# Altium schematic sheet Power.SchDoc
size 254 x 190 mm; SheetNumber: 2; SheetTotal: 3
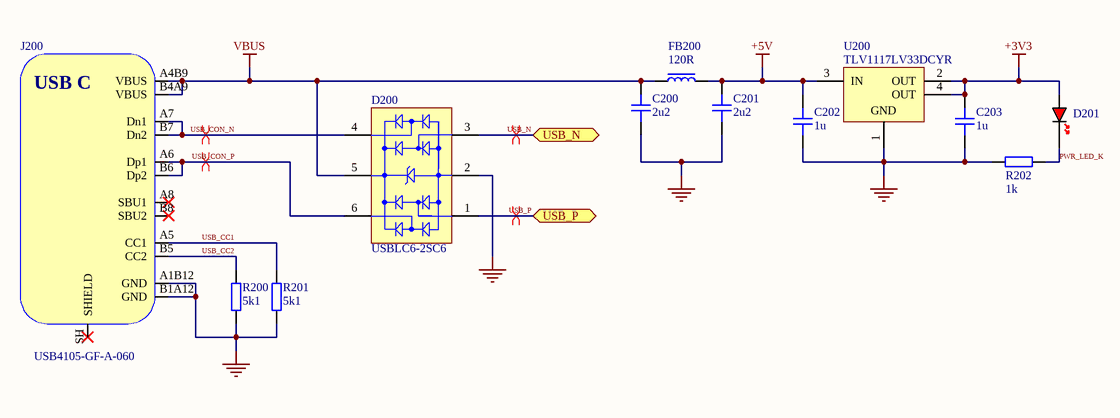
[diagram p0: Power.SchDoc]

## Parts
C200  2u2  [CAP_0805]
C201  2u2  [CAP_0805]
C202  1u  [CAP_0805]
C203  1u  [CAP_0805]
D200  USBLC6-2SC6  [STM-SOT23-6L_V]
D201  RED  [LED_0603_RED]  (value not drawn)
FB200  120R  [FB_0603]
J200  USB4105-GF-A-060  [USB4105-GF-A-060]
R200  5k1  [RES_0603]
R201  5k1  [RES_0603]
R202  1k  [RES_0603]
U200  TLV1117LV33DCYR  [DCY0004A_N]

## Ports
USB_N (bidir, see Overview[2B], Main[2B]), USB_P (bidir, see Overview[2B], Main[2B])

## Nets
+3V3: C203.1 D201.A U200.2(OUT) U200.4(OUT)
+5V: C201.1 C202.1 FB200.2 U200.3(IN)
GND: C200.1 C201.2 C202.2 C203.2 D200.2(GND) J200.A1B12(GND) J200.B1A12(GND) R200.1 R201.1 R202.2 U200.1(GND)
VBUS: C200.2 D200.5(VBUS) FB200.1 J200.A4B9(VBUS) J200.B4A9(VBUS)
PWR_LED_K: D201.K R202.1
USB_CC1: J200.A5(CC1) R201.2
USB_CC2: J200.B5(CC2) R200.2
USB_CON_N: D200.4(I/O_3) J200.A7(Dn1) J200.B7(Dn2)
USB_CON_P: D200.6(I/O_4) J200.A6(Dp1) J200.B6(Dp2)
USB_N: D200.3(I/O_2) ; port USB_N
USB_P: D200.1(I/O_1) ; port USB_P

Not connected (* = marked no-connect by the designer): J200 A8(SBU1)* B8(SBU2)* SH(SHIELD)*

## Layout directives
differential pair; differential pair class DIFF_USB_CON: USB_CON_N, USB_CON_P
differential pair; differential pair class DIFF_USB: USB_N, USB_P

## Notes on the sheet
- (in symbol USB4105-GF-A-060) USB C

## Library data of the parts
C200-C203 = CAP_0805_16V: Capacitor SMD 0805 16V
D200 = CMP-2000-05378-1: Very low capacitance ESD protection, 3.5 pF, -40 to 125 degC, 6-Pin SOT23, RoHS, Tape and Reel; Manufacturer: STMicroelectronics; Polarity: Uni-Directional; Clamping Voltage: 17V; Rad Hardened: No; Product Height (mm): 1.3mm; Leakage Current (Max): 0.15uA; Product Length (mm): 3.05mm; Number of Elements: 1; Peak Pulse Current: 5A; Configuration: Dual; Reverse Breakdown Voltage: 6V; Working Voltage (Max): 5V; Capacitance Value: 3.5pF; Suppressor Type: DiodeArrays; Product Depth (mm): 1.75mm; Test Current (It): 1mA; Package / Case: SOT-23; Operating Temperature Max Deg. C: 125C; Package Description: 6-Pin Small Outline Transistor, Body 2.925 x 1.625 mm, Pitch 0.95 mm; Package Reference: SOT23-6L; Datasheet Version: Rev. 5, 10/2011; Operating Temperature Min Deg. C: -40C; Mounting Style: SurfaceMount; Direction Type: Uni-Directional; Mounting: SurfaceMount; Pin Count: 6; Leakage Current: 0.15uA; Packaging: TapeandReel; Operating Temperature Classification: Automotive; Clamping Voltage (Max): 17V; Manufacturer URL: http://www.st.com/; Reverse Stand-off Voltage: 5V; Datasheet URL: http://www.st.com/st-web-ui/static/active/en/resource/technical/document/datasheet/CD00050750.pdf; Working Voltage: 5V; Operating Temp Range: -40Cto125C
D201 = LED_0603_RED: LED 0603 RED SMD
FB200 = FB_0603: Ferrite Bead SMD 0603
J200 = USB4105-GF-A-060: USB Connector Type C SMT 12 Pin; Manufacturer: GCT; Manufacturer Part Number: USB4105-GF-A-060
R200-R202 = RES_0603: Resistor SMD 0603; Manufacturer: *; Manufacturer Part Number: *; Distributor Link: *
U200 = CMP-0395-00503-2: Single Output LDO, 1 A, Fixed 3.3 V Output, 2 to 5.5 V Input, 4-pin SOT-223 (DCY), -40 to 125 degC, Green (RoHS & no Sb/Br); Manufacturer: Texas Instruments; Vout Adj(Min)(V): 3.3; Vdo(Typ)(mV): 1200; Iq(Typ)(mA): 0.05; Accuracy(%): 2; Iout(Max)(A): 1; SubFamily: Single Channel LDO; Vin(Max)(V): 5.5; PackageReference: DCY0004A; PackageDescription: 4-Pin Plastic Small Outline, Body 3.5 x 6.5 mm, Pitch 2.3 mm; Vout Adj(Max)(V): 3.3; Mounting Technology: Surface Mount; ComponentLink2Description: Datasheet; ComponentLink1Description: Manufacturer URL; PartNumber: TLV1117LV33DCYR; ComponentLink3Description: Package Specification; ComponentLink1URL: http://www.ti.com/; ComponentLink2URL: http://www.ti.com/general/docs/lit/getliterature.tsp?genericPartNumber=TLV1117LV33&fileType=pdf; Fixed Output Options(V): 3.3; PackageVersion: 4202506/B; Vin(Min)(V): 2; DatasheetVersion: SBVS160A; Eco-Plan: Green (RoHS & no Sb/Br); ComponentLink3URL: http://www.ti.com/litv/pdf/mpds094a; Code_JEDEC: TO-261